# Altium schematic sheet DigitalSensors.SchDoc: Digital sensors
size 292 x 193 mm; Author: Natalia Krzykała; CompanyName: Politechnika Warszawska; Organization: EITI; Address1: Nowowiejska 15/19; Address2: 00-665 Warszawa; Revision: 3; SheetNumber: 3; SheetTotal: 5; HTTPLink: www.pw.edu.pl; Group_Name: Under Pressure; ProjName: Sweet Dreams
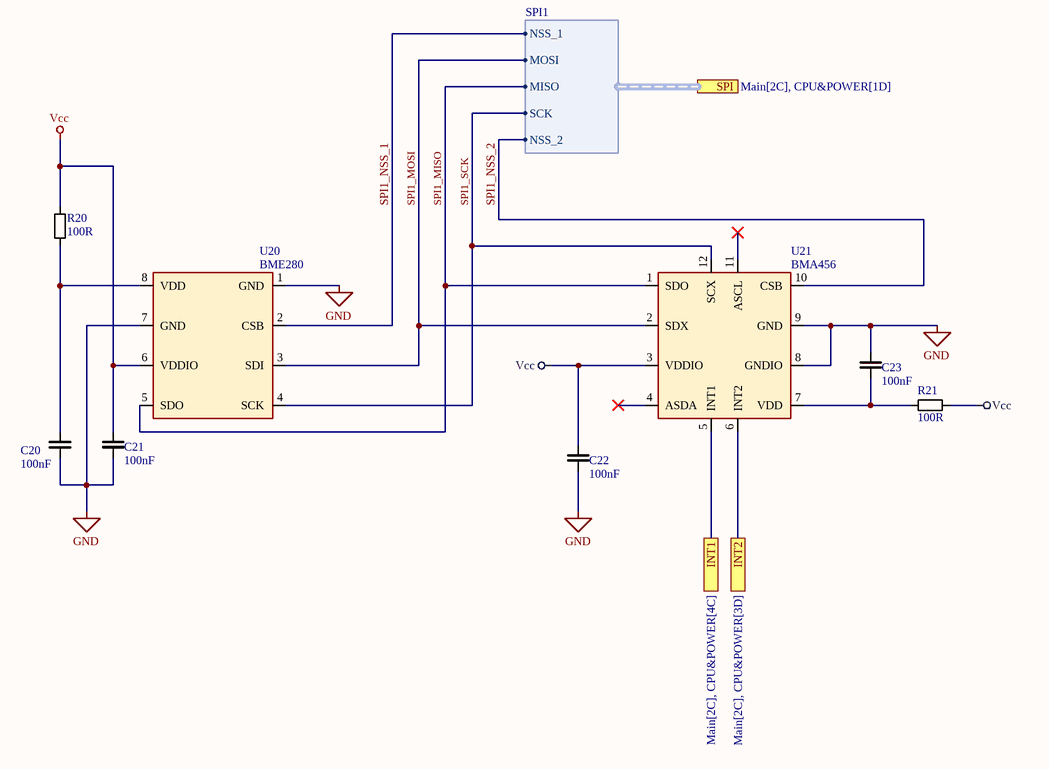
[diagram p0: DigitalSensors.SchDoc]

## Parts
C20  100nF  [0402_CAP]
C21  100nF  [0402_CAP]
C22  100nF  [0402_CAP]
C23  100nF  [0402_CAP]
R20  100R  [0402_RES]
R21  100R  [0402_RES]
U20  BME280  [MODBME280_m]
U21  BMA456  [BOSCH_LGA-12]

## Ports
INT1 (see Main[2C], CPU&POWER[4C]), INT2 (see Main[2C], CPU&POWER[3D]), SPI (harness SPI1, see Main[2C], CPU&POWER[1D])

## Harnesses
SPI1: MOSI, MISO, SCK, NSS_1, NSS_2

## Nets
GND: C20.1 C21.1 C22.1 C23.2 U20.1(GND) U20.7(GND) U21.8(GNDIO) U21.9(GND)
Vcc: C21.2 C22.2 R20.2 R21.2 U20.6(VDDIO) U21.3(VDDIO)
INT1: U21.5(INT1) ; port INT1
INT2: U21.6(INT2) ; port INT2
SPI1_MISO: U20.5(SDO) U21.1(SDO) ; port SPI.MISO
SPI1_MOSI: U20.3(SDI) U21.2(SDX) ; port SPI.MOSI
SPI1_NSS_1: U20.2(CSB) ; port SPI.NSS_1
SPI1_NSS_2: U21.10(CSB) ; port SPI.NSS_2
SPI1_SCK: U20.4(SCK) U21.12(SCX) ; port SPI.SCK
NetC20_2: C20.2 R20.1 U20.8(VDD)
NetC23_1: C23.1 R21.1 U21.7(VDD)

Not connected (* = marked no-connect by the designer): U21 4(ASDA)* 11(ASCL)*

## Notes on the sheet
- Data:
- Tytuł:
- Rev.:
- Rozm.:
- A4
- Strona:
- z
- PBL4
- Opracował:

## Library data of the parts
C20-C23 = Cap: Ceramic capacitor
R20 R21 = RES: Resistor